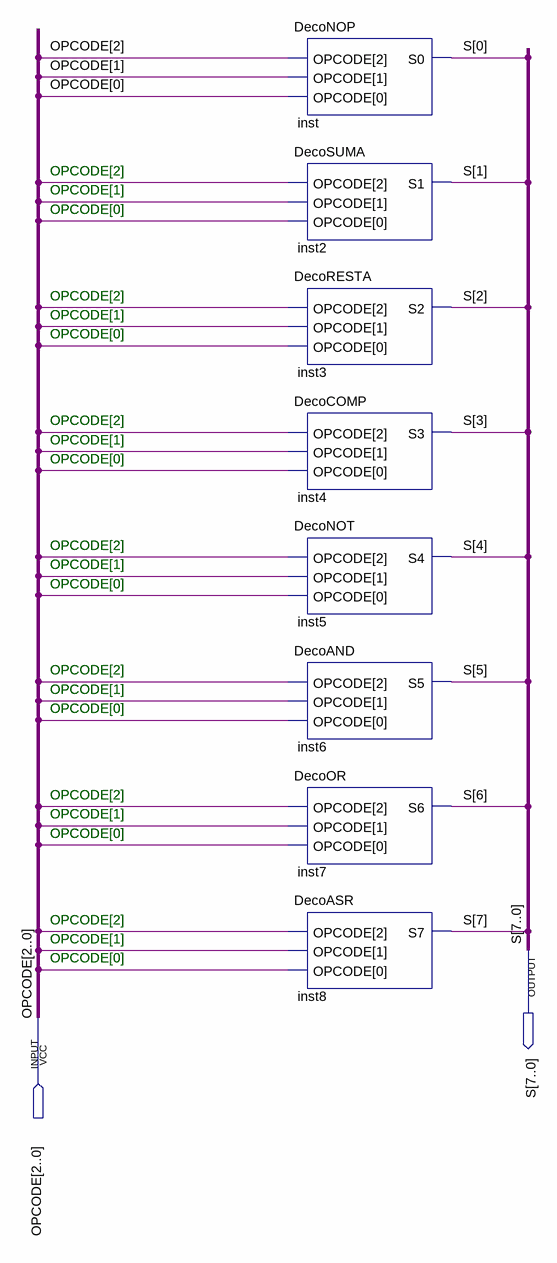
[diagram p0: schematic sheet]
// Quartus schematic Decodificador.bdf as structural Verilog: 8 symbols, 2 pins
module Decodificador (
  input  [2:0] OPCODE,
  output [7:0] S
);

  DecoNOP inst (.OPCODE(OPCODE), .S0(S[0]));
  DecoSUMA inst2 (.OPCODE(OPCODE), .S1(S[1]));
  DecoRESTA inst3 (.OPCODE(OPCODE), .S2(S[2]));
  DecoCOMP inst4 (.OPCODE(OPCODE), .S3(S[3]));
  DecoNOT inst5 (.OPCODE(OPCODE), .S4(S[4]));
  DecoAND inst6 (.OPCODE(OPCODE), .S5(S[5]));
  DecoOR inst7 (.OPCODE(OPCODE), .S6(S[6]));
  DecoASR inst8 (.OPCODE(OPCODE), .S7(S[7]));

  // Notes on the sheet:
  //   OPCODE[2]
  //   OPCODE[1]
  //   OPCODE[0]
  //   OPCODE[2]
  //   OPCODE[1]
  //   OPCODE[0]
  //   OPCODE[2]
  //   OPCODE[1]
  //   OPCODE[0]
  //   OPCODE[2]
  //   OPCODE[1]
  //   OPCODE[0]
  //   OPCODE[2]
  //   OPCODE[1]
  //   OPCODE[0]
  //   OPCODE[2]
  //   OPCODE[1]
  //   OPCODE[0]
  //   OPCODE[2]
  //   OPCODE[1]
  //   OPCODE[0]
endmodule
